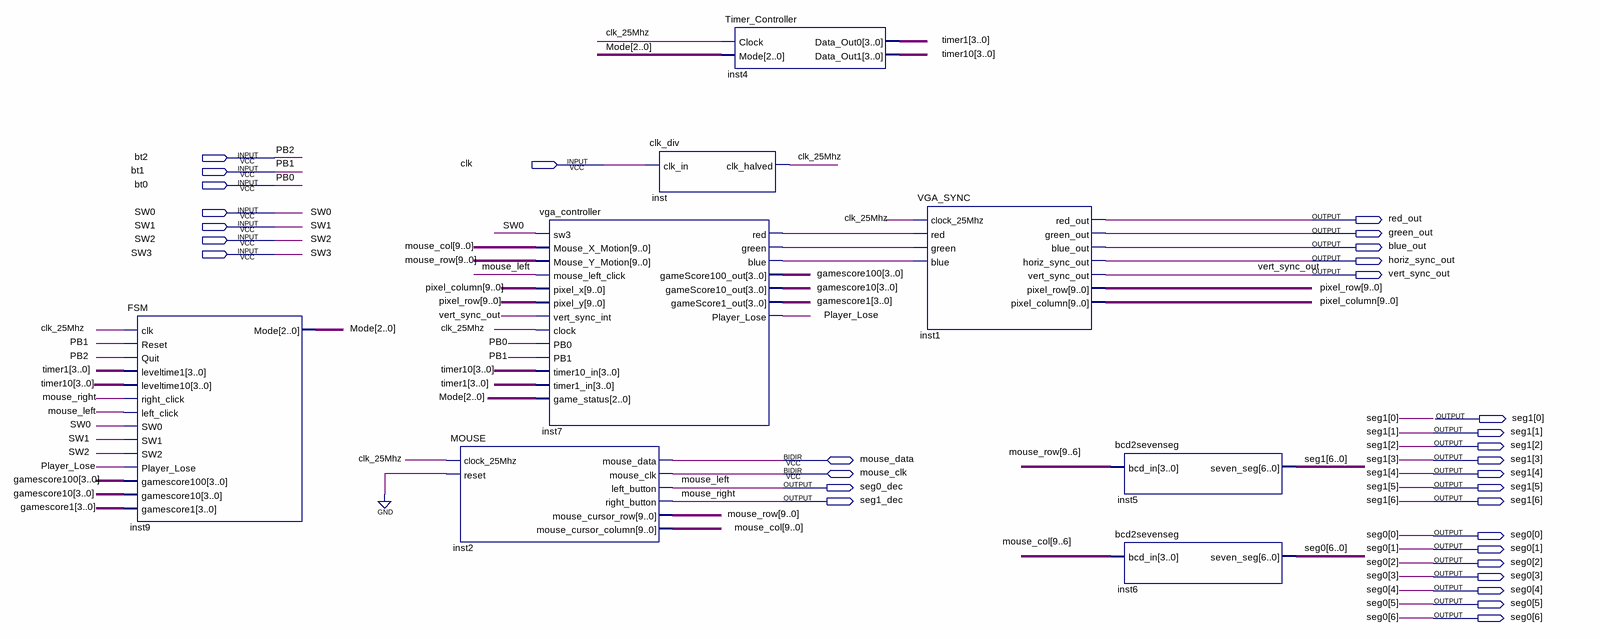
[diagram p0: schematic sheet]
// Quartus schematic Game.bdf as structural Verilog: 8 symbols, 31 pins
module Game (
  input  bt2,
  input  clk,
  input  bt1,
  input  bt0,
  input  SW0,
  input  SW1,
  input  SW2,
  input  SW3,
  inout  mouse_data,
  inout  mouse_clk,
  output red_out,
  output green_out,
  output blue_out,
  output horiz_sync_out,
  output vert_sync_out,
  output [6:0] seg1,
  output seg0_dec,
  output seg1_dec,
  output [6:0] seg0
);

  wire clk_25Mhz, inst7_blue, inst7_green, inst7_red, Player_Lose;
  wire [2:0] Mode;
  wire [3:0] gamescore1, gamescore10, gamescore100, timer1, timer10;
  wire [9:0] mouse_col, mouse_row, pixel_column, pixel_row;

  FSM inst9 (
    .clk(clk_25Mhz), .Reset(bt1), .Quit(bt2), .leveltime1(timer1), .leveltime10(timer10),
    .right_click(seg1_dec), .left_click(seg0_dec), .SW0(SW0), .SW1(SW1), .SW2(SW2),
    .Player_Lose(Player_Lose), .gamescore100(gamescore100), .gamescore10(gamescore10),
    .gamescore1(gamescore1), .Mode(Mode));
  MOUSE inst2 (
    .clock_25Mhz(clk_25Mhz), .reset(1'b0), .left_button(seg0_dec), .right_button(seg1_dec),
    .mouse_cursor_row(mouse_row), .mouse_cursor_column(mouse_col), .mouse_data(mouse_data),
    .mouse_clk(mouse_clk));
  vga_controller inst7 (
    .sw3(SW0), .Mouse_X_Motion(mouse_col), .Mouse_Y_Motion(mouse_row), .mouse_left_click(seg0_dec),
    .pixel_x(pixel_column), .pixel_y(pixel_row), .vert_sync_int(vert_sync_out), .clock(clk_25Mhz), .PB0(bt0),
    .PB1(bt1), .timer10_in(timer10), .timer1_in(timer1), .game_status(Mode), .red(inst7_red),
    .green(inst7_green), .blue(inst7_blue), .gameScore100_out(gamescore100), .gameScore10_out(gamescore10),
    .gameScore1_out(gamescore1), .Player_Lose(Player_Lose));
  clk_div inst (.clk_in(clk), .clk_halved(clk_25Mhz));
  Timer_Controller inst4 (.Clock(clk_25Mhz), .Mode(Mode), .Data_Out0(timer1), .Data_Out1(timer10));
  VGA_SYNC inst1 (
    .clock_25Mhz(clk_25Mhz), .red(inst7_red), .green(inst7_green), .blue(inst7_blue), .red_out(red_out),
    .green_out(green_out), .blue_out(blue_out), .horiz_sync_out(horiz_sync_out),
    .vert_sync_out(vert_sync_out), .pixel_row(pixel_row), .pixel_column(pixel_column));
  bcd2sevenseg inst5 (.bcd_in(mouse_row[9:6]), .seven_seg(seg1));
  bcd2sevenseg inst6 (.bcd_in(mouse_col[9:6]), .seven_seg(seg0));

  // Other names for the same wires on the sheet: mouse_left = seg0_dec; mouse_right = seg1_dec; PB0 = bt0; PB1 = bt1;
  //   PB2 = bt2
endmodule
